# Altium schematic sheet DB10005_PowerManagement.SchDoc: Power management
size A4; SheetNumber: 4; SheetTotal: 7
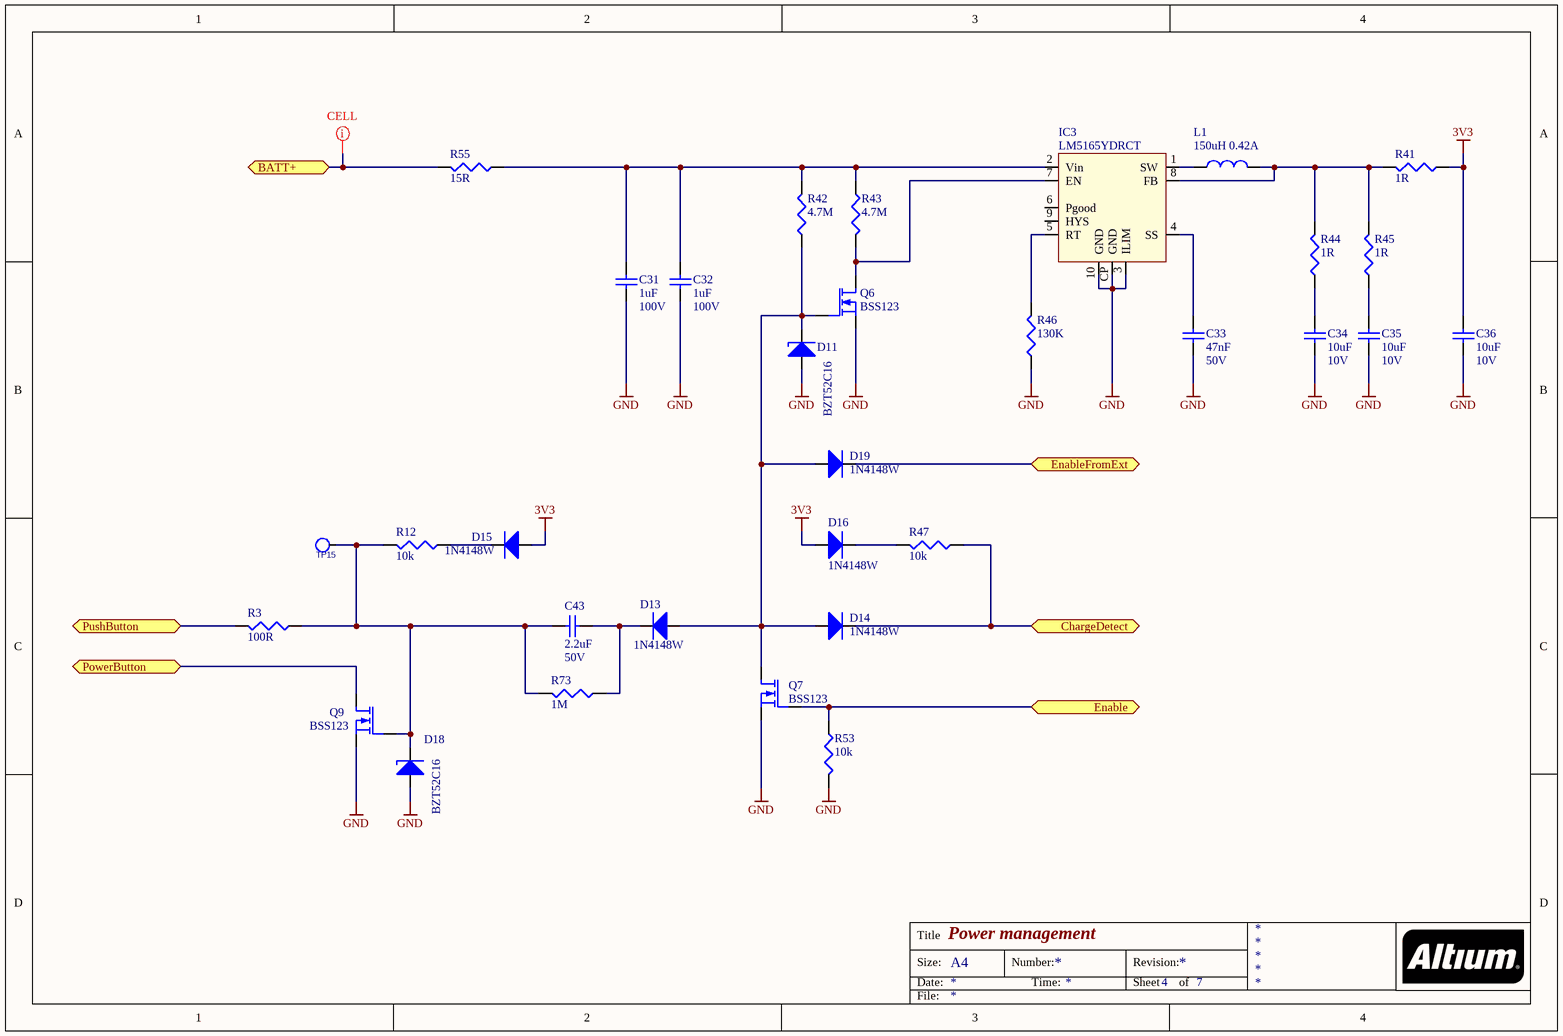
[diagram p0: DB10005_PowerManagement.SchDoc]

## Parts
C31  1uF  Voltage Rating: 100V  [C-1206]
C32  1uF  Voltage Rating: 100V  [C-1206]
C33  47nF  Voltage Rating: 50V  [C0603]
C34  10uF  Voltage Rating: 10V  [C-0805]
C35  10uF  Voltage Rating: 10V  [C-0805]
C36  10uF  Voltage Rating: 10V  [C-0805]
C43  2.2uF  Voltage Rating: 50V  [C-0805]
D11  BZT52C16  [SOD123]
D13  1N4148W  [SOD123]
D14  1N4148W  [SOD123]
D15  1N4148W  [SOD123]
D16  1N4148W  [SOD123]
D18  BZT52C16  [SOD123]
D19  1N4148W  [SOD123]
IC3  LM5165YDRCT  [PWSON10]
L1  150uH 0.42A  [WE-TPC 4828, MH]
Q6  BSS123  [SOT-23]
Q7  BSS123  [SOT-23]
Q9  BSS123  [SOT-23]
R3  100R  [0805]
R12  10k  [0402]
R41  1R  [0805]
R42  4.7M  [0805]
R43  4.7M  [0805]
R44  1R  [0805]
R45  1R  [0805]
R46  130K  [0603]
R47  10k  [0402]
R53  10k  [0402]
R55  15R  [0805]
R73  1M  [0402]
TP15  1.3TP  [TP2-1.3MM]  (value not drawn)  (no BOM)

## Ports
BATT+, ChargeDetect, Enable, EnableFromExt, PowerButton, PushButton

## Nets
3V3: C36.2 D15.1(A) D16.1(A) R41.1
GND: C31.1 C32.1 C33.1 C34.1 C35.1 C36.1 D11.1(A) D18.1(A) IC3.3(ILIM) IC3.10(GND) IC3.CP(GND) Q6.S Q7.S Q9.S R46.1 R53.2
BATT+: R55.2 ; port BATT+
ChargeDetect: D14.2(K) R47.1 ; port ChargeDetect
Enable: Q7.G R53.1 ; port Enable
EnableFromExt: D19.2(K) ; port EnableFromExt
PowerButton: Q9.D ; port PowerButton
PushButton: R3.2 ; port PushButton
NetC31_2: C31.2 C32.2 IC3.2(Vin) R42.2 R43.1 R55.1
NetC33_2: C33.2 IC3.4(SS)
NetC34_2: C34.2 R44.1
NetC35_2: C35.2 R45.1
NetC43_1: C43.1 D18.2(K) Q9.G R3.1 R12.2 R73.2 TP15.1(TP)
NetC43_2: C43.2 D13.2(K) R73.1
NetD11_2: D11.2(K) D13.1(A) D14.1(A) D19.1(A) Q6.G Q7.D R42.1
NetD15_2: D15.2(K) R12.1
NetD16_2: D16.2(K) R47.2
NetIC3_1: IC3.1(SW) L1.1
NetIC3_5: IC3.5(RT) R46.2
NetIC3_7: IC3.7(EN) Q6.D R43.2
NetIC3_8: IC3.8(FB) L1.2 R41.2 R44.2 R45.2

Not connected (* = marked no-connect by the designer): IC3 6(Pgood) 9(HYS)

## Layout directives
net class CELL: BATT+

## Notes on the sheet
- Title
- Size:
- Date:
- A4
- Number:
- Time:
- Revision:
- Sheet
- of
- File:

## Library data of the parts
C31 C32 = 1uF/1206/CER/100V: Capacitor, 1uF, 100V, X7R; Capacitance Tolerance: ± 10%; Capacitor Case Style: 1206; Brand Number: 12061C105K4Z2A; Brand: AVX; Dielectric Characteristic: X7R; Capacitance: 1uF; Temperature Range: -55°C to +125°C; Price: 0,52; Order Code Supplier: 1833855; Supplier: Farnell
C33 = 47nF/0603/CER/50V: Capacitor, 47nF, 50V, X7R; Capacitance Tolerance: ± 10%; Capacitor Case Style: 0603; Brand Number: MCCA000249; Brand: MULTICOMP; Dielectric Characteristic: X7R; Capacitance: 47nF; Temperature Range: -55°C to +125°C; Price: 0,009; Order Code Supplier: 1759116; Supplier: Farnell
C34-C36 = 10uF/0805/CER/10V: Capacitor, 10uF, 10V, X7R; Capacitance Tolerance: ± 10%; Capacitor Case Style: 0805; Brand Number: GRM21BR71A106KE51L; Brand: MURATA; Dielectric Characteristic: X7R; Capacitance: 10uF; Temperature Range: -55°C to +125°C; Price: 0,36; Order Code Supplier: 1828828; Supplier: Farnell
C43 = 2.2uF/0805/CER/50V: Capacitor, 2.2uF, 50V,  X7R; Dielectric Characteristic: X5R; Capacitance Tolerance: ± 10%; Capacitor Case Style: 0805; Brand Number: GRM219R61H225KE15D; Brand: MURATA; Capacitance: 2.2uF; Temperature Range: -55°C to +125°C; Price: 0,113; Order Code Supplier: 2611933; Supplier: Farnell
D11 D18 = BZT52C16: Diode Zener, Vz: 16V, If: 0.1A, Vf: 0.9V; Brand: Diodes; Case Style: SOD-123; Brand Number: BZT52C16; Forward Current: 0.1A; Forward Voltage: 0.9V; Order Code Supplier: 1902431; Price: 0,087; Supplier: Farnell; Temperature Range: -65°C to +150°C; Zener Voltage: 16V
D13-D16 D19 = MMSD4148T1G: Diode, Vrrm: 100V, If: 0.15A, Vf: 1V; Brand: ON SEMICONDUCTOR; Case Style: SOD-123; Forward Current: 0.2A; Price: 0,19; Brand Number: MMSD4148T1G; Order Code Supplier: 9556079; Supplier: Farnell; Temperature Range: -65°C to +150°C; Vrrm: 100V; Forward Voltage: 1V
IC3 = LM5165Y: Buck Vreg 150mA 3V3 out 5-65Vin; Brand: Texas Instruments; Case Style: MSOP-8; Price: 3,70; Order Code Supplier: 595-LM5165YDRCT; Brand Number: LM5165YDRCT; Temperature Range: -40°C to +85°C; Supplier: Mouser
L1 = 744043151: 150UH, 30%, 0.42A; Brand: Wurth; Case Style: WE-TPC 4828; DC Resistance: 0.770ohm; Brand Number: 744043151; DC Current: 0.42A; Inductance: 150uH; Order Code Supplier: 2082517; Price: 1,36; Q Factor: *; Supplier: Farnell; Temperature Range: -40°C to +125°C
Q6 Q7 Q9 = BSS123: Mosfet, N-channel, Vds:100V, Id:0.15A, Vgs-th:2.8V, Rds-on:3.5ohm; Brand: NXP; Drain Current: 0.15A; Drain Source Voltage: 100V; Gate Source Voltage: 20V; On Resistance: 3.5ohm; Threshold Voltage: 2.8V; Brand Number: BSS123; Case Style: SOT-23; Order Code Supplier: 1510764; Price: 0,082; Supplier: Farnell; Temperature Range: -55°C to +150°C; Transistor Polarity: N-channel
R3 = 100/0805/0250W/150V: Resistor, 100R, 1%, 0.25W, 150V, 100PPM, 0805; Brand: MULTICOMP; Brand Number: MCHP05W4F1000T5E; Case Style: 0805; Order Code Supplier: 1576445; Power Rating: 0.25W; Price: 0,089; Resistance: 100R; Supplier: Farnell; Temperature Coefficient: ± 100PPM; Temperature Range: -55°C to +155°C; Voltage Rating: 150V
R12 R47 R53 = 10k/0402/0063W/50V: Resistor, 10k, 0.1%, 0.0625W, 50V, 100PPM, 0402; Brand: VISHAY DRALORIC; Brand Number: CRCW040210K0FKED; Power Rating: 0.063W; Case Style: 0402; Order Code Supplier: 2121730; Price: 0,0005; Resistance: 10k; Supplier: Farnell; Temperature Coefficient: ± 100PPM; Temperature Range: -55°C to +125°C; Voltage Rating: 50V
R41 R44 R45 = 1/0805/0250W/150V: Resistor, 1R, 1%, 0.25W, 150V, 200PPM, 0805; Brand: PANASONIC; Brand Number: ERJ6BQF1R0V; Case Style: 0805; Order Code Supplier: 1717826; Power Rating: 0.25W; Price: 0,28; Resistance: 1R; Supplier: Farnell; Temperature Coefficient: ± 200PPM; Temperature Range: -55°C to +125°C; Voltage Rating: 150V
R42 R43 = 4.7M/0805/0250W/150V: Resistor, 4.7M, 1%, 0.25W, 150V, 100PPM, 0805; Brand: MULTICOMP; Brand Number: MCHP05W4F4704T5E; Case Style: 0805; Order Code Supplier: 1576516; Power Rating: 0.25W; Price: 0,089; Resistance: 4.7M; Supplier: Farnell; Temperature Coefficient: ± 100PPM; Temperature Range: -55°C to +155°C; Voltage Rating: 150V
R46 = 130K/0603/0063W/50V: Resistor, 130K, 1%, 0.063W, 50V, 100PPM, 0603; Brand: VISHAY DRALORIC; Brand Number: CRCW0603130KFKEA; Case Style: 0603; Order Code Supplier: 2122632; Power Rating: 0.063W; Price: 0,017; Resistance: 130K; Supplier: Farnell; Temperature Coefficient: ± 100PPM; Temperature Range: -55°C to +125°C; Voltage Rating: 50V
R55 = 15/0805/0125W/150V: Resistor, 15R, 0.1%, 0.125W, 150V, 15PPM, 0805; Brand: YAGEO; Brand Number: RC0805JR-0715RL; Case Style: 0805; Order Code Supplier: 9233784; Power Rating: 0.125W; Price: 0,0161; Resistance: 15R; Supplier: Farnell; Temperature Coefficient: ± 15PPM; Temperature Range: -55°C to +155°C; Voltage Rating: 150V
R73 = 1M/0402/0063W/50V: Resistor, 1M, 0.1%, 0.0625W, 50V, 100PPM, 0402; Brand: VISHAY DRALORIC; Brand Number: CRCW04021M00FKED; Power Rating: 0.063W; Case Style: 0402; Order Code Supplier: 2121984; Price: 0,0006; Resistance: 1M; Supplier: Farnell; Temperature Coefficient: ± 100PPM; Temperature Range: -55°C to +125°C; Voltage Rating: 50V
TP15 = TESTPT4: 1.3mm